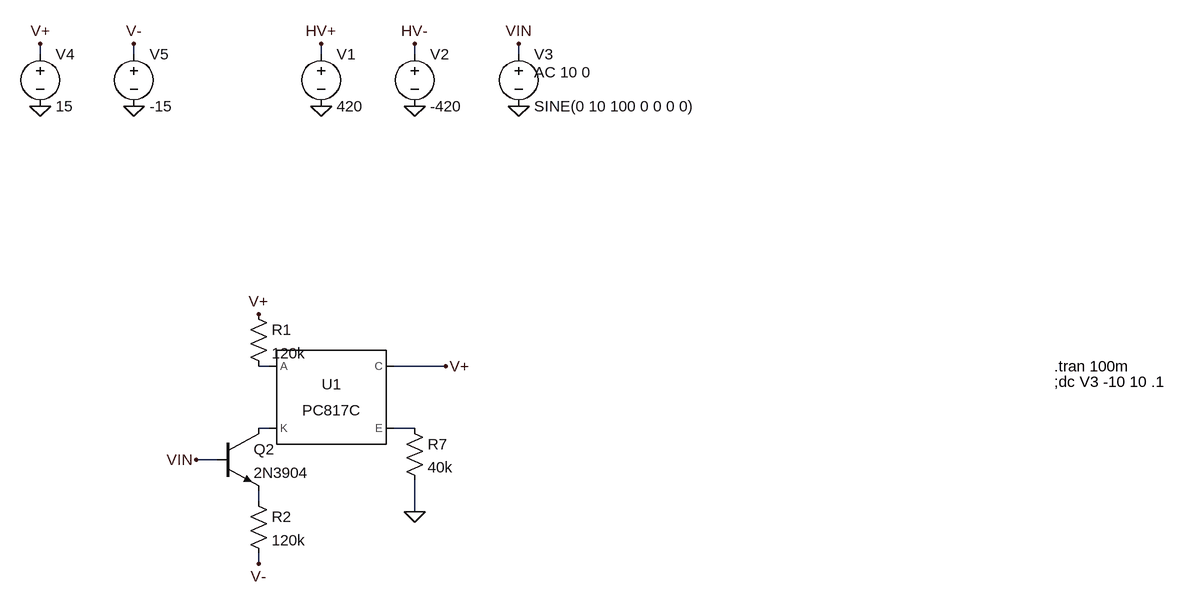
[diagram p0: schematic opto.asc]
opto.asc, the LTspice schematic file:
Version 4
SHEET 1 1216 932
WIRE -544 -208 -544 -224
WIRE -400 -208 -400 -224
WIRE -112 -208 -112 -224
WIRE 32 -208 32 -224
WIRE 192 -208 192 -224
WIRE -192 272 -208 272
WIRE 80 272 0 272
WIRE -192 368 -208 368
WIRE 32 368 0 368
WIRE -272 416 -304 416
WIRE -208 480 -208 464
WIRE 32 496 32 448
WIRE -208 576 -208 560
FLAG -112 -128 0
FLAG 32 -128 0
FLAG 192 -128 0
FLAG -112 -224 HV+
FLAG 32 -224 HV-
FLAG 192 -224 VIN
FLAG -544 -128 0
FLAG -400 -128 0
FLAG -544 -224 V+
FLAG -400 -224 V-
FLAG 32 496 0
FLAG 80 272 V+
FLAG -304 416 VIN
FLAG -208 192 V+
FLAG -208 576 V-
SYMBOL voltage -112 -224 R0
WINDOW 123 0 0 Left 2
WINDOW 39 0 0 Left 2
SYMATTR InstName V1
SYMATTR Value 420
SYMBOL voltage 32 -224 R0
WINDOW 123 0 0 Left 2
WINDOW 39 0 0 Left 2
SYMATTR InstName V2
SYMATTR Value -420
SYMBOL voltage 192 -224 R0
WINDOW 123 24 44 Left 2
WINDOW 39 0 0 Left 2
SYMATTR Value2 AC 10 0
SYMATTR InstName V3
SYMATTR Value SINE(0 10 100 0 0 0 0)
SYMBOL voltage -544 -224 R0
WINDOW 123 0 0 Left 2
WINDOW 39 0 0 Left 2
SYMATTR InstName V4
SYMATTR Value 15
SYMBOL voltage -400 -224 R0
WINDOW 123 0 0 Left 2
WINDOW 39 0 0 Left 2
SYMATTR InstName V5
SYMATTR Value -15
SYMBOL res 16 352 R0
SYMATTR InstName R7
SYMATTR Value 40k
SYMBOL Optos\\PC817C -96 320 R0
SYMATTR InstName U1
SYMBOL npn -272 368 R0
SYMATTR InstName Q2
SYMATTR Value 2N3904
SYMBOL res -224 176 R0
SYMATTR InstName R1
SYMATTR Value 120k
SYMBOL res -224 464 R0
SYMATTR InstName R2
SYMATTR Value 120k
TEXT 1016 296 Left 2 !;dc V3 -10 10 .1
TEXT 1016 272 Left 2 !.tran 100m

The netlist it stands for:
* opto.asc
V1 HV+ 0 420
V2 HV- 0 -420
V3 VIN 0 SINE(0 10 100 0 0 0 0) AC 10 0
V4 V+ 0 15
V5 V- 0 -15
R7 N003 0 40k
XU1 N001 N002 V+ N003 PC817 Igain=2.3m  ; PC817C, pins A K C E
Q2 N002 VIN N004 0 2N3904
R1 V+ N001 120k
R2 N004 V- 120k
.model NPN NPN
.model PNP PNP
.lib standard.bjt
;dc V3 -10 10 .1
.tran 100m
.lib PC817.sub
.backanno
.end